# Altium schematic sheet amp.SchDoc
size A4
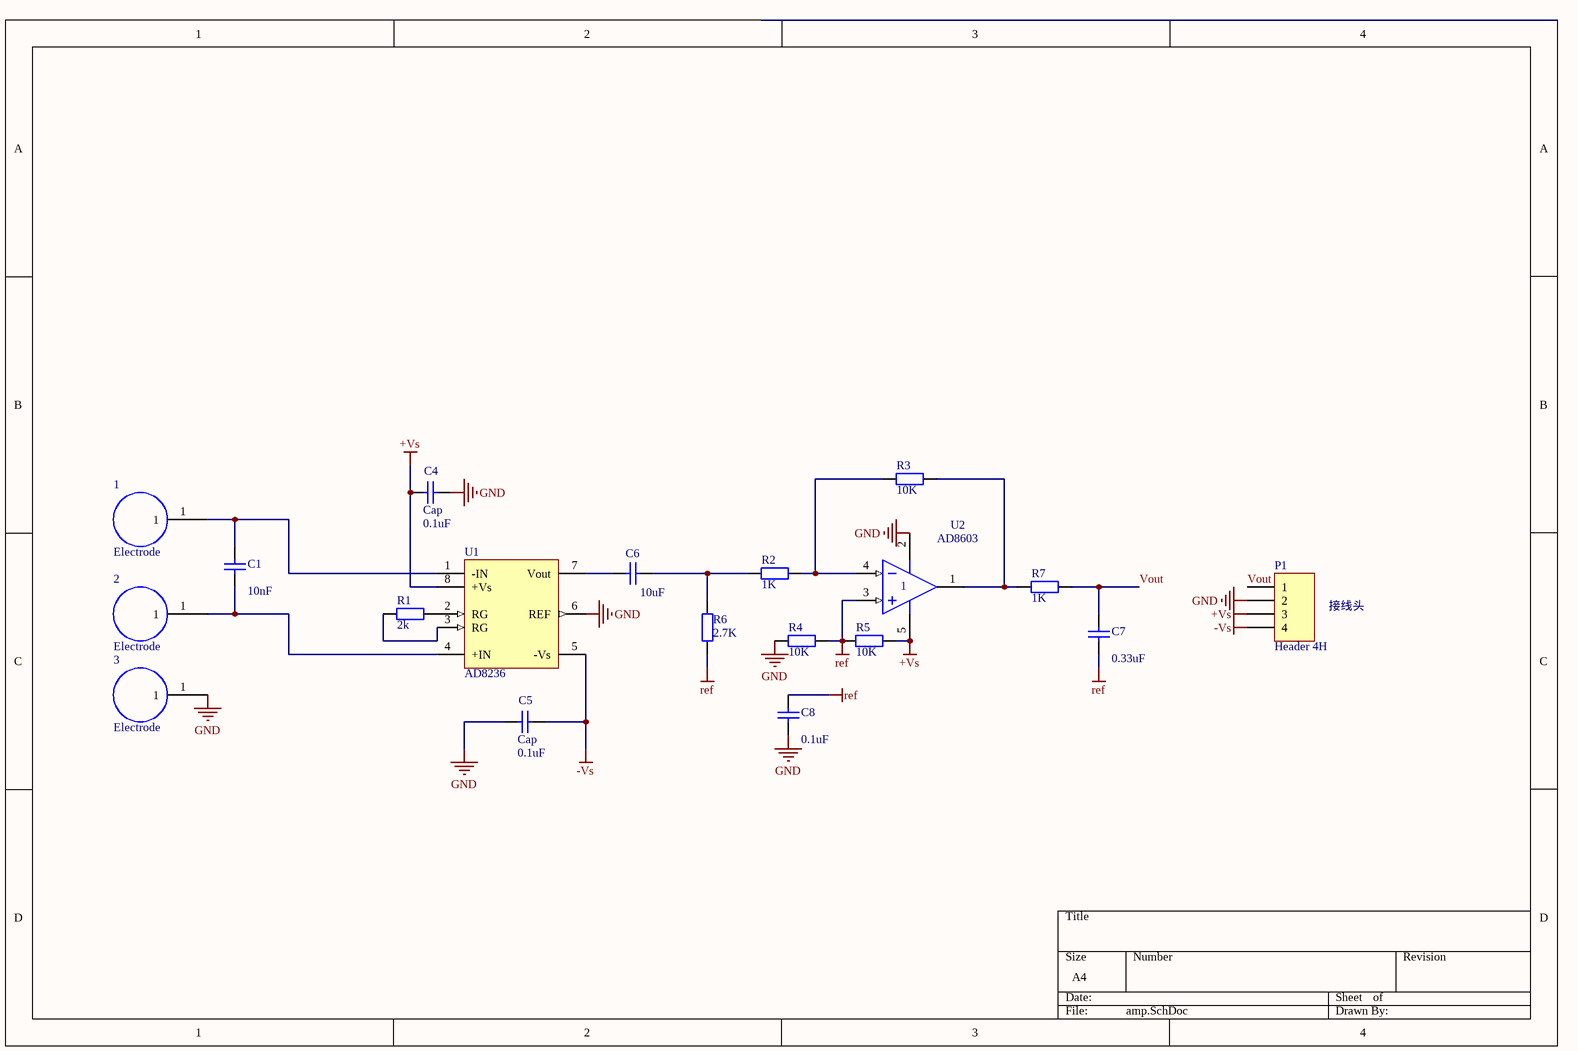
[diagram p0: amp.SchDoc]

## Parts
1  Electrode  [elec-diff]
2  Electrode  [elec-diff]
3  Electrode  [elec-ref]
C1  value 10nF  [0603]
C4  Cap  value 0.1uF  [0603]
C5  Cap  value 0.1uF  [0603]
C6  value 10uF  [0603]
C7  value 0.33uF  [0603]
C8  value 0.1uF  [0603]
P1  Header 4H  [BAT3]
R1  2k  [0603]
R2  1K  [0603]
R3  10K  [0603]
R4  10K  [0603]
R5  10K  [0603]
R6  2.7K  [0603]
R7  1K  [0603]
U1  AD8236  [MSOP-8]
U2  AD8603  [SOT23-5AM]

## Nets
+Vs: C4.1 P1.3 R5.2 U1.8(+Vs) U2.5(V-)
-Vs: C5.2 P1.4 U1.5(-Vs)
GND: 3.1 C4.2 C5.1 C8.1 P1.2 R4.1 U1.6(REF) U2.2(V+)
ref: C7.1 C8.2 R4.2 R5.1 R6.1 U2.3(IN+)
Vout: C7.2 P1.1 R7.2
Net1_1: 1.1 C1.2 U1.1(-IN)
Net2_1: 2.1 C1.1 U1.4(+IN)
NetC6_1: C6.1 R2.1 R6.2
NetC6_2: C6.2 U1.7(Vout)
NetR1_1: R1.1 U1.2(RG)
NetR1_2: R1.2 U1.3(RG)
NetR2_2: R2.2 R3.1 U2.4(IN-)
NetR3_2: R3.2 R7.1 U2.1(OUT)

## Notes on the sheet
- 接线头

## Library data of the parts
C1 C4-C8 = Cap: Capacitor; Published: 8-Jun-2000; LatestRevisionDate: 17-Jul-2002; LatestRevisionNote: Re-released for DXP Platform.; PackageReference: RAD-0.3; Publisher: Altium Limited
P1 = Header 4H: Header, 4-Pin, Right Angle; LatestRevisionDate: 17-Jul-2002; LatestRevisionNote: Re-released for DXP Platform.; Publisher: Altium Limited
R1-R7 = Res2: Resistor; Published: 8-Jun-2000; LatestRevisionDate: 17-Jul-2002; LatestRevisionNote: Re-released for DXP Platform.; PackageReference: AXIAL-0.4; Publisher: Altium Limited
U1 = INA128UA: Precision, Low-Power Instrumentation Amplifiers; Published: 8-Jun-2000; LatestRevisionDate: 13-Apr-2006; LatestRevisionNote: IPC-7351 Footprint Added.; DatasheetVersion: Oct-1996; PackageReference: 182H; Publisher: Altium Limited; PackageDescription: 8-Pin Small Outline Integrated Circuit 1.27 mm Pitch; Code_JEDEC: MS-012-AA; Code_IPC: SOIC127P600-8; ComponentLink1Description: Manufacturer Link; ComponentLink1URL: http://www.ti.com/; ComponentLink2Description: Datasheet; ComponentLink2URL: http://www-s.ti.com/sc/ds/INA128.pdf